# EAGLE design DashHub (EAGLE 9.6.2)
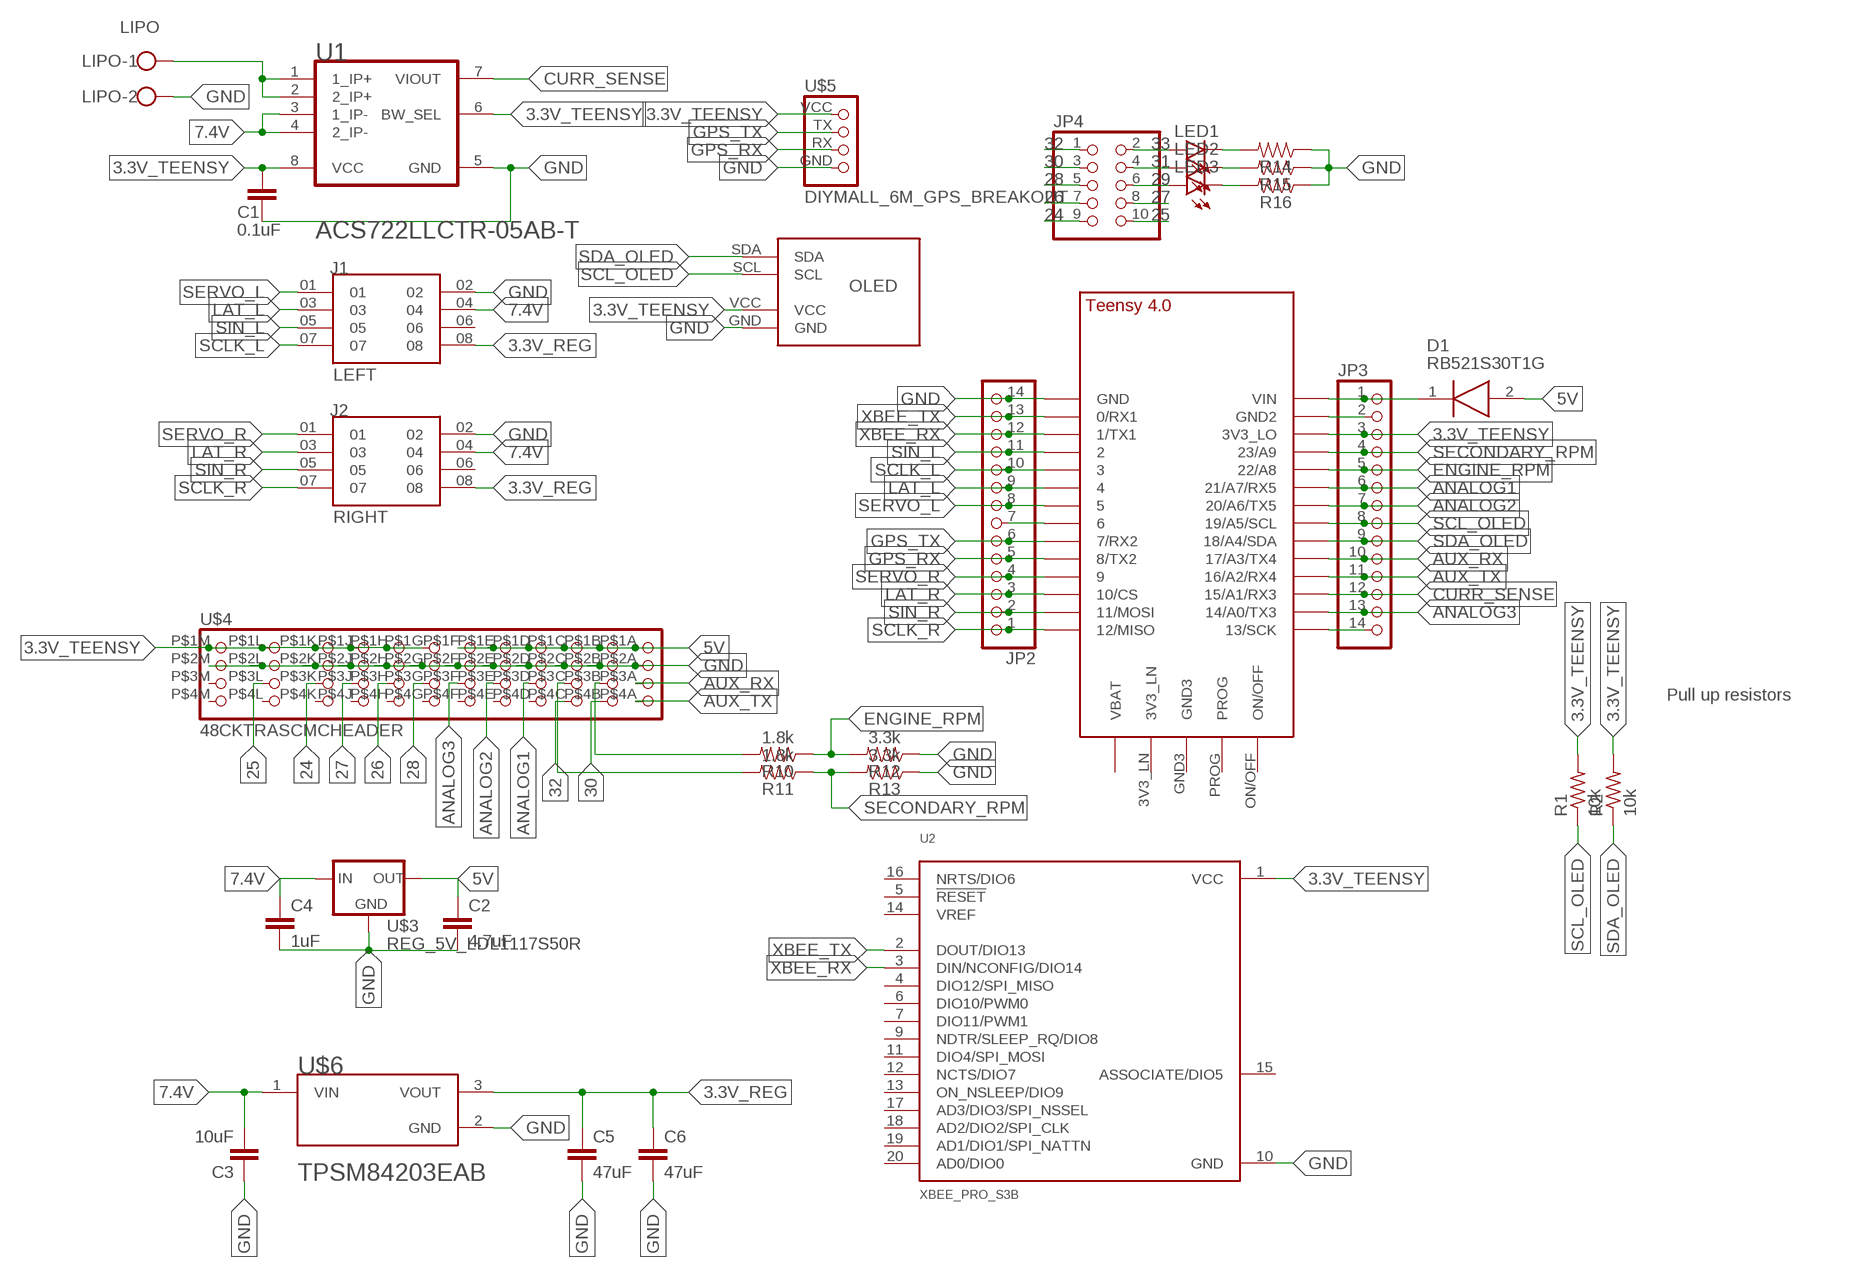
[diagram p0: schematic, sheet 1]

## Parts
C1  0.1uF  C-EUC0402  [C0402]
C2  4.7uF  CAP_SMDC0603  [C0603]
C3  10uF  CAP_SMDC1206  [C1206]
C4  1uF  CAP_SMDC1206  [C1206]
C5  47uF  CAP_SMDC1206  [C1206]
C6  47uF  CAP_SMDC1206  [C1206]
D1  RB521S30T1G  [SODFL1608X70N]
J1  LEFT  ESW-104-23-L-D  [SAMTEC_ESW-104-23-L-D]
J2  RIGHT  ESW-104-23-L-D  [SAMTEC_ESW-104-23-L-D]
JP2  PINHD-1X14  [1X14]
JP3  PINHD-1X14  [1X14]
JP4  PINHD-2X5  [2X05]
LED1  LEDCHIPLED_1206  [CHIPLED_1206]
LED2  LEDCHIPLED_1206  [CHIPLED_1206]
LED3  LEDCHIPLED_1206  [CHIPLED_1206]
LIPO  LIPO  W237-102  [W237-102]
R1  10k  RES_SMDR0603  [R0603]
R2  10k  RES_SMDR0603  [R0603]
R10  1.8k  RESISTORAXIAL-0.3  [AXIAL-0.3]
R11  1.8k  RESISTORAXIAL-0.3  [AXIAL-0.3]
R12  3.3k  RESISTORAXIAL-0.3  [AXIAL-0.3]
R13  3.3k  RESISTORAXIAL-0.3  [AXIAL-0.3]
R14  RESISTORAXIAL-0.3  [AXIAL-0.3]
R15  RESISTORAXIAL-0.3  [AXIAL-0.3]
R16  RESISTORAXIAL-0.3  [AXIAL-0.3]
U1  ALLEGRO_MICROSYSTEMS_ACS722LLCTR-05AB-TALLEGRO_MICROSYSTEMS_ACS722LLCTR-05AB-T_0_0  [ALLEGRO_MICROSYSTEMS_ACS722LLCTR-05AB-T_0]
U2  XBEE_PRO_S3B  [XBEE_PRO_S3B]
U$1  TEENSY_4.0-BASIC  [TEENSY_4.0-BASIC]
U$2  OLED_SSD1306  [OLED_SSD1306]
U$3  REG_5V_LDL1117S50R  [SOT230P700X180-4N]
U$4  48CKTRASCMCHEADER  [48CKTRASCMCHEADER]
U$5  DIYMALL_6M_GPS_BREAKOUT  [DIYMALL_6M_GPS_BREAKOUT]
U$6  TPSM84205EAB  [TPSM84205EAB]

## Nets
3.3V_REG: C5.1 C6.1 J1.08 J2.08 U$6.3(VOUT)
3.3V_TEENSY: C1.2 JP3.3 R1.2 R2.2 U1.6(BW_SEL) U1.8(VCC) U2.1(VCC) U$1.3V3_LO U$2.VCC U$4.P$1G(1G) U$4.P$1H(1H) U$4.P$1J(1J) U$4.P$1K(1K) U$4.P$1L(1L) U$4.P$1M(1M) U$5.VCC
5V: C2.1 D1.2(A) U$3.2(OUT) U$3.4(OUT) U$4.P$1A(1A) U$4.P$1B(1B) U$4.P$1C(1C) U$4.P$1D(1D) U$4.P$1E(1E) U$4.P$1F(1F)
7.4V: C3.2 C4.1 J1.04 J2.04 U1.3(1_IP-) U1.4(2_IP-) U$3.3(IN) U$6.1(VIN)
24: JP4.9 U$4.P$3K(3K)
25: JP4.10 U$4.P$3L(3L)
26: JP4.7 U$4.P$3H(3H)
27: JP4.8 U$4.P$3J(3J)
28: JP4.5 U$4.P$3G(3G)
29: JP4.6 LED3.A
30: JP4.3 U$4.P$4B(4B)
31: JP4.4 LED2.A
32: JP4.1 U$4.P$4C(4C)
33: JP4.2 LED1.A
ANALOG1: JP3.6 U$1.21/A7(21/A7/RX5) U$4.P$3D(3D)
ANALOG2: JP3.7 U$1.20/A6(20/A6/TX5) U$4.P$3E(3E)
ANALOG3: JP3.13 U$1.14/A0(14/A0/TX3) U$4.P$3F(3F)
AUX_RX: JP3.10 U$1.17/A3(17/A3/TX4) U$4.P$3A(3A)
AUX_TX: JP3.11 U$1.16/A2(16/A2/RX4) U$4.P$4A(4A)
CURR_SENSE: JP3.12 U1.7(VIOUT) U$1.15/A1(15/A1/RX3)
ENGINE_RPM: JP3.5 R10.P$1 R12.P$2 U$1.22/A8
GND: C1.1 C2.2 C3.1 C4.2 C5.2 C6.2 J1.02 J2.02 JP2.14 LIPO.2 R12.P$1 R13.P$1 R14.P$1 R15.P$1 R16.P$1 U1.5(GND) U2.10(GND) U$1.GND U$2.GND U$3.1(GND) U$4.P$2A(2A) U$4.P$2B(2B) U$4.P$2C(2C) U$4.P$2D(2D) U$4.P$2E(2E) U$4.P$2F(2F) U$4.P$2G(2G) U$4.P$2H(2H) U$4.P$2J(2J) U$4.P$2K(2K) U$4.P$2L(2L) U$4.P$2M(2M) U$5.GND U$6.2(GND)
GND2: JP3.2 U$1.GND2
GPS_RX: JP2.5 U$1.8(8/TX2) U$5.RX
GPS_TX: JP2.6 U$1.7(7/RX2) U$5.TX
LAT_L: J1.03 JP2.9 U$1.4/CANRX
LAT_R: J2.03 JP2.3 U$1.10/CS
LIPO_IN: LIPO.1 U1.1(1_IP+) U1.2(2_IP+)
N$1: JP2.7 U$1.6
N$2: D1.1(K) JP3.1 U$1.VIN
N$11: LED1.C R14.P$2
N$12: LED2.C R15.P$2
N$13: LED3.C R16.P$2
N$23: R10.P$2 U$4.P$3B(3B)
N$24: R11.P$2 U$4.P$3C(3C)
SCL_OLED: JP3.8 R1.1 U$1.19/A5/SCL U$2.SCL
SCLK_D: JP3.14 U$1.13/SCK
SCLK_L: J1.07 JP2.10 U$1.3/CANTX
SCLK_R: J2.07 JP2.1 U$1.12/MISO
SDA_OLED: JP3.9 R2.1 U$1.18/A4/SDA U$2.SDA
SECONDARY_RPM: JP3.4 R11.P$1 R13.P$2 U$1.23/A9
SERVO_L: J1.01 JP2.8 U$1.5
SERVO_R: J2.01 JP2.4 U$1.9/CS
SIN_L: J1.05 JP2.11 U$1.2
SIN_R: J2.05 JP2.2 U$1.11/MOSI
XBEE_RX: JP2.12 U2.3(DIN/NCONFIG/DIO14) U$1.1/TX(1/TX1)
XBEE_TX: JP2.13 U2.2(DOUT/DIO13) U$1.0/RX(0/RX1)
Unconnected: J1.06 J2.06 U2.4(DIO12/SPI_MISO) U2.5(!RESET) U2.6(DIO10/PWM0) U2.7(DIO11/PWM1) U2.9(NDTR/SLEEP_RQ/DIO8) U2.11(DIO4/SPI_MOSI) U2.12(NCTS/DIO7) U2.13(ON_NSLEEP/DIO9) U2.14(VREF) U2.15(ASSOCIATE/DIO5) U2.16(NRTS/DIO6) U2.17(AD3/DIO3/SPI_NSSEL) U2.18(AD2/DIO2/SPI_CLK) U2.19(AD1/DIO1/SPI_NATTN) U2.20(AD0/DIO0) U$1.3V3_LN U$1.GND3 U$1.ON/OFF U$1.PROG U$1.VBAT\(VBAT) U$4.P$3M(3M) U$4.P$4D(4D) U$4.P$4E(4E) U$4.P$4F(4F) U$4.P$4G(4G) U$4.P$4H(4H) U$4.P$4J(4J) U$4.P$4K(4K) U$4.P$4L(4L) U$4.P$4M(4M)

## Notes on the sheet
- Pull up resistors

## Library data of the parts
C1 = rcl:C-EU: CAPACITOR, European symbol; SPICEPREFIX: C
C2-C6 = GTOR - Passive Components:CAP_SMD: CAPACITOR, European symbol; SPICEPREFIX: C
D1 = RB521S30T1G:RB521S30T1G: Schottky Barrier Diode Source: Datasheet <http://www.onsemi.com/pub/Collateral/RB521S30T1-D.PDF>; ARROW_PART_NUMBER: RB521S30T1G; ARROW_PRICE-STOCK: https://www.arrow.com/en/products/rb521s30t1g/on-semiconductor; DESCRIPTION: Schottky Barrier Diode; HEIGHT: 0.7mm; MANUFACTURER_NAME: ON Semiconductor; MANUFACTURER_PART_NUMBER: RB521S30T1G; MOUSER_PART_NUMBER: 863-RB521S30T1G; MOUSER_PRICE-STOCK: https://www.mouser.co.uk/ProductDetail/ON-Semiconductor/RB521S30T1G?qs=xZq1yRCsb1eKFKS8TVH%2Fqg%3D%3D
J1 J2 = ESW-104-23-L-D:ESW-104-23-L-D; MANUFACTURER: Samtec Inc.; PARTREV: R; STANDARD: Manufacturer Recommendations
JP2 JP3 = pinhead:PINHD-1X14: PIN HEADER
JP4 = pinhead:PINHD-2X5: PIN HEADER
LED1-LED3 = led:LED: LED OSRAM: - CHIPLED LG R971, LG N971, LY N971, LG Q971, LY Q971, LO R971, LY R971 LH N974, LH R974 LS Q976, LO Q976, LY Q976 LO Q996 - Hyper CHIPLED LW Q18S LB Q993, LB Q99A, LB R99A - SideLED LS A670, LO A670, LY A670, LG A670, LP A670 LB A673, LV A673, LT A673, LW A673 LH A674 LY A675 LS A676, LA A676, LO A676, LY A676, LW A676 LS A679, LY A679, LG A679 - Hyper Micro SIDELED® LS Y876, LA Y876, LO Y876, LY Y876 LT Y87S - SmartLED LW L88C, LW L88S LB L89C, LB L89S, LG L890 LS L89K, LO L89K, LY L89K LS L896, LA L896, LO L896, LY L896 - TOPLED LS T670, LO T670, LY T670, LG T670, LP T670 LSG T670, LSP T670, LSY T670, LOP T670, LYG T670 LG T671, LOG T671, LSG T671 LB T673, LV T673, LT T673, LW T673 LH T674 LS T676, LA T676, LO T676, LY T676, LB T676, LH T676, LSB T676, LW T676 LB T67C, LV T67C, LT T67C, LS T67K, LO T67K, LY T67K, LW E67C LS E67B, LA E67B, LO E67B, LY E67B, LB E67C, LV E67C, LT E67C LW T67C LS T679, LY T679, LG T679 LS T770, LO T770, LY T770, LG T770, LP T770 LB T773, LV T773, LT T773, LW T773 LH T774 LS E675, LA E675, LY E675, LS T675 LS T776, LA T776, LO T776, LY T776, LB T776 LHGB T686 LT T68C, LB T68C - Hyper Mini TOPLED® LB M676 - Mini TOPLED Santana® LG M470 LS M47K, LO M47K, LY M47K Source: http://www.osram.convergy.de LUXEON: - LUMILED® LXK2-PW12-R00, LXK2-PW12-S00, LXK2-PW14-U00, LXK2-PW14-V00 LXK2-PM12-R00, LXK2-PM12-S00, LXK2-PM14-U00 LXK2-PE12-Q00, LXK2-PE12-R00, LXK2-PE12-S00, LXK2-PE14-T00, LXK2-PE14-U00 LXK2-PB12-K00, LXK2-PB12-L00, LXK2-PB12-M00, LXK2-PB14-N00, LXK2-PB14-P00, LXK2-PB14-Q00 LXK2-PR12-L00, LXK2-PR12-M00, LXK2-PR14-Q00, LXK2-PR14-R00 LXK2-PD12-Q00, LXK2-PD12-R00, LXK2-PD12-S00 LXK2-PH12-R00, LXK2-PH12-S00 LXK2-PL12-P00, LXK2-PL12-Q00, LXK2-PL12-R00 Source: www.luxeon.com KINGBRIGHT: KA-3528ASYC Source: www.kingbright.com
LIPO = con-wago-500:W237-102: WAGO SCREW CLAMP; MPN: 237-102; OC_FARNELL: unknown; OC_NEWARK: 70K9898
R1 R2 = GTOR - Passive Components:RES_SMD: RESISTOR, American symbol; SPICEPREFIX: R
R10-R16 = SparkFun-Resistors:RESISTOR: Generic Resistor Package
U1 = Allegro MicroSystems - ACS722LLCTR-05AB-T:ALLEGRO_MICROSYSTEMS_ACS722LLCTR-05AB-T: ALEG-ACS722-SOIC-8; CIIVA_IDS: 20395501; COMPONENT_LINK_1_DESCRIPTION: Manufacturer URL; COMPONENT_LINK_1_URL: http://www.allegromicro.com/; COMPONENT_LINK_3_DESCRIPTION: Package Specification; COMPONENT_LINK_3_URL: http://www.allegromicro.com/~/media/Files/Datasheets/ACS711-Datasheet.ashx?la=en; DATASHEET: http://www.allegromicro.com/~/media/Files/Datasheets/ACS722-Datasheet.ashx?la=en; FOOTPRINT_VARIANT_NAME_0: Manufacturer Recommended; IMPORTED: yes; IMPORTED_FROM: vault; IMPORT_TS: 1521843836; IP_MAX: 5 A; IP_MIN: -5 A; MF: Allegro MicroSystems; MOUNTING_TECHNOLOGY: Surface Mount; MPN: ACS722LLCTR-05AB-T; PACKAGE_DESCRIPTION: 8-Pin Small Outline Integrated Package, Body 4.9 x 3.9 mm, Pitch 1.27 mm; PACKING: Tape and Reel; PREFIX: U; RELEASE_DATE: 1439174706; ROHS: Yes; TEMPERATURE_MAX: 150 degC; TEMPERATURE_MIN: -40 degC; VAULT_GUID: 23CF8DBA-208E-4E0F-A1B8-C7EE78FE94DB; VAULT_REVISION: 60592E21-24CC-4A18-AB0C-D50A27DFFA24; VCC_MAX: 3.6 V; VCC_MIN: 3 V
U2 = GTOR - Microcontroller:XBEE_PRO_S3B: XBee-PRO 900HP DigiMesh 900 MHz 200 Kbps RF Module with U.FL Connector; DESCRIPTION: General ISM < 1GHz Transceiver Module 900MHz Antenna Not Included, RP-SMA Through Hole; DIGI-KEY_PART_NUMBER: 602-1293-ND; MF: Digi International; MP: XBP9B-XCST-001; PACKAGE: Module Digi International
U$1 = Teensy-4.0:TEENSY_4.0-BASIC
U$2 = GTOR - Breakout Boards:OLED_SSD1306
U$3 = GTOR - Active Components:REG_5V_LDL1117S50R
U$4 = GTOR - Connectors:48CKTRASCMCHEADER
U$5 = GTOR - Breakout Boards:DIYMALL_6M_GPS_BREAKOUT
U$6 = GTOR - Active Components:TPSM84205EAB

## Board
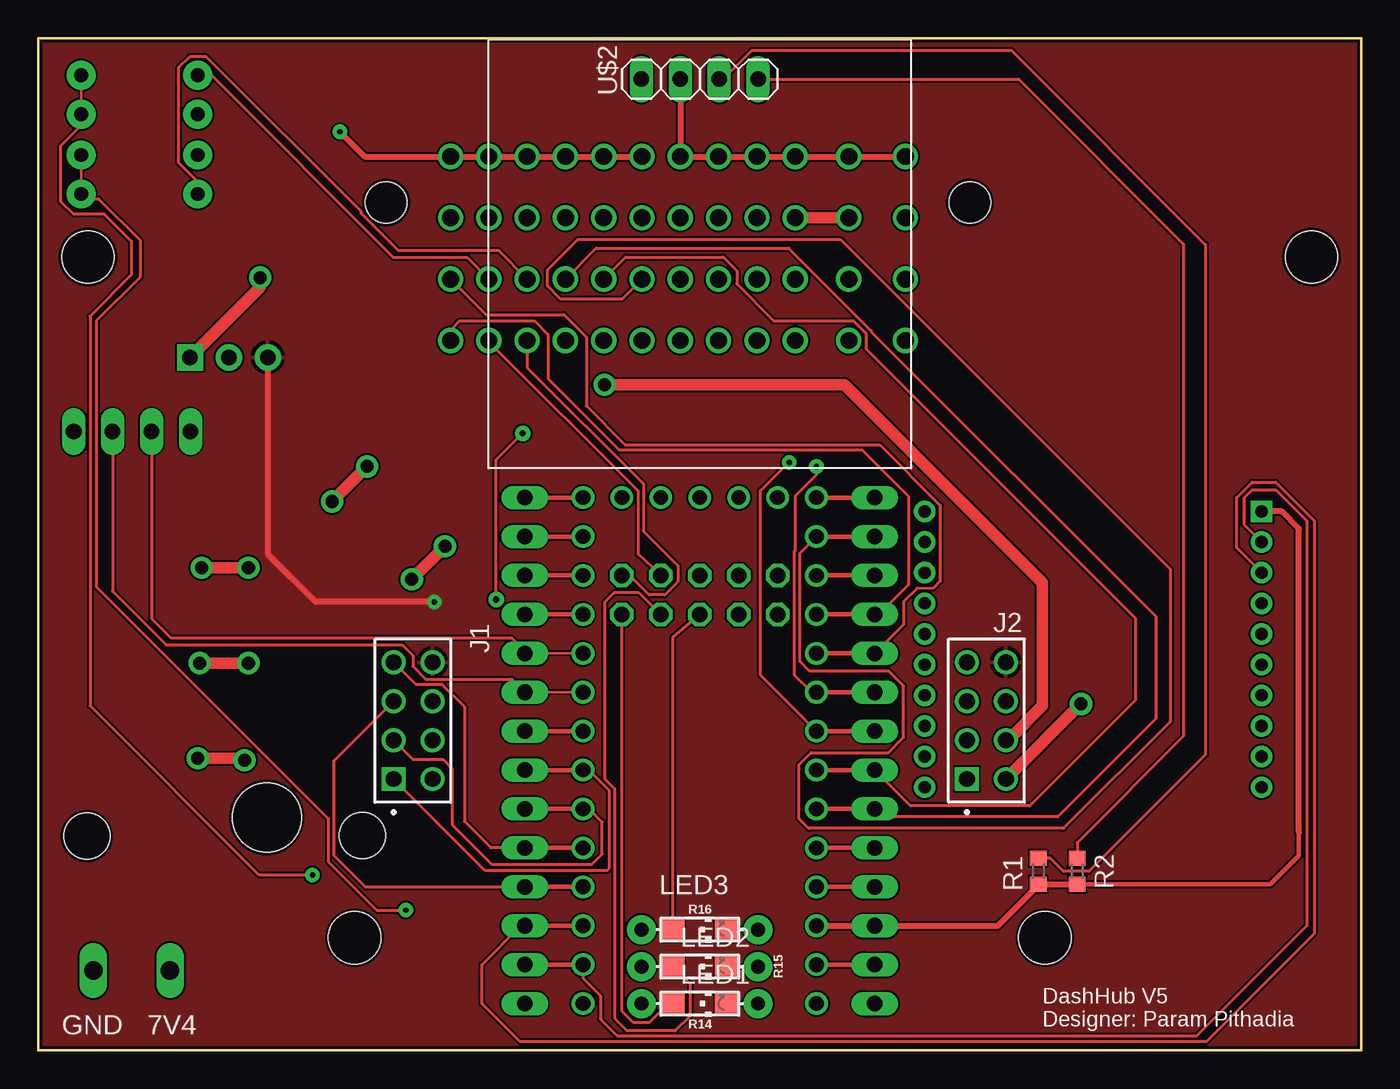
[diagram p1: board, top side]
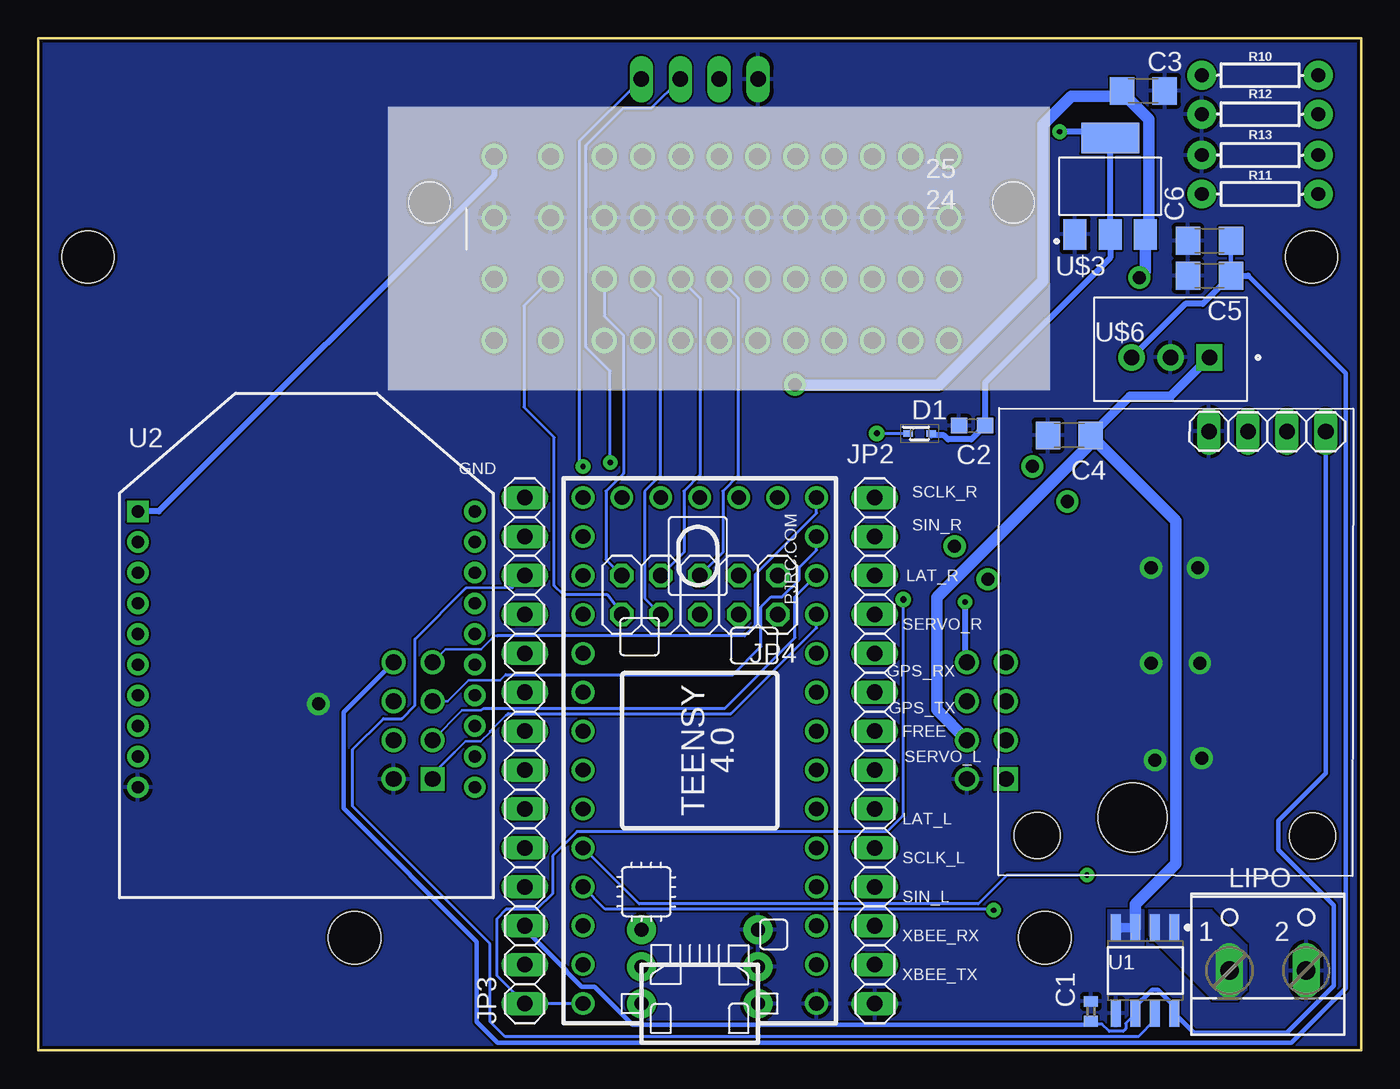
[diagram p2: board, bottom side, seen from below]

Size 86.36 x 66.04 mm. Coordinates in mm from the lower left corner, seen from the top.
Outline: 0,66.04 0,0 86.36,0 86.36,66.04 0,66.04
Copper layers (1*16): Top 0.035mm / dielectric 1.6mm / Bottom 0.035mm
Design rules "designrulecheck_jlcpcb_2layers": minimum track width 5mil, minimum drill 0.3mm, track to track 5mil, track to pad 0.2mm, pad to pad 5mil, via to via 10mil, smd to smd 5mil, copper to edge 0.2mm, drill to drill 0.5mm, minimum pad ring 10mil, minimum via ring 0.3mm, stop-mask expansion 4mil, vias tented up to drill 0mil, thermal gap 10mil
Holes 3.4 mm at 65.71,7.34 83.11,51.77 20.65,7.34 3.25,51.77

### Footprints (pad centres in the part's own frame; a part is rotated, then mirrored left to right if it is on the bottom)
C0402 = smd 0.7 x 0.9: 1 -0.65,0; 2 0.65,0
C0603 = smd 1.1 x 1: 1 -0.85,0; 2 0.85,0
C1206 = smd 1.6 x 1.8: 1 -1.4,0; 2 1.4,0
SODFL1608X70N = smd 0.64 x 0.42: 1 -0.75,0; 2 0.75,0
SAMTEC_ESW-104-23-L-D = drill 1.04 pad 1.39 square: 01 0,0 | drill 1.04 pad 1.39: 02 0,2.54; 03 -2.54,0; 04 -2.54,2.54; 05 -5.08,0; 06 -5.08,2.54; 07 -7.62,0; 08 -7.62,2.54
1X14 = drill 1.016 long: 1 -16.51,0; 2 -13.97,0; 3 -11.43,0; 4 -8.89,0; 5 -6.35,0; 6 -3.81,0; 7 -1.27,0; 8 1.27,0; 9 3.81,0; 10 6.35,0; 11 8.89,0; 12 11.43,0; 13 13.97,0; 14 16.51,0
2X05 = drill 1.016 octagon: 1 -5.08,-1.27; 2 -5.08,1.27; 3 -2.54,-1.27; 4 -2.54,1.27; 5 0,-1.27; 6 0,1.27; 7 2.54,-1.27; 8 2.54,1.27; 9 5.08,-1.27; 10 5.08,1.27
CHIPLED_1206 = smd 1.5 x 1.5: A 0,-1.75; C 0,1.75
W237-102 = drill 1.194 long: 1 -2.5,-1.27; 2 2.5,-1.27
R0603 = smd 1 x 1.1: 1 -0.85,0; 2 0.85,0
AXIAL-0.3 = drill 0.9 pad 1.88: P$1 -3.81,0; P$2 3.81,0
ALLEGRO_MICROSYSTEMS_ACS722LLCTR-05AB-T_0 = smd 0.65 x 1.75: 1 -1.905,-2.8; 2 -0.635,-2.8; 3 0.635,-2.8; 4 1.905,-2.8; 5 1.905,2.8; 6 0.635,2.8; 7 -0.635,2.8; 8 -1.905,2.8
XBEE_PRO_S3B = drill 0.8 pad 1.4 square: 1 -11,8.75 | drill 0.8 pad 1.4: 2 -11,6.75; 3 -11,4.75; 4 -11,2.75; 5 -11,0.75; 6 -11,-1.25; 7 -11,-3.25; 8 -11,-5.25; 9 -11,-7.25; 10 -11,-9.25; 11 11,-9.25; 12 11,-7.25; 13 11,-5.25; 14 11,-3.25; 15 11,-1.25; 16 11,0.75; 17 11,2.75; 18 11,4.75; 19 11,6.75; 20 11,8.75
TEENSY_4.0-BASIC = drill 0.965: 0/RX -13.97,-7.62; 1/TX -11.43,-7.62; 2 -8.89,-7.62; 3/CANTX -6.35,-7.62; 3V3_LN 16.51,-2.54; 3V3_LO -11.43,7.62; 4/CANRX -3.81,-7.62; 5 -1.27,-7.62; 6 1.27,-7.62; 7 3.81,-7.62; 8 6.35,-7.62; 9/CS 8.89,-7.62; 10/CS 11.43,-7.62; 11/MOSI 13.97,-7.62; 12/MISO 16.51,-7.62; 13/SCK 16.51,7.62; 14/A0 13.97,7.62; 15/A1 11.43,7.62; 16/A2 8.89,7.62; 17/A3 6.35,7.62; 18/A4/SDA 3.81,7.62; 19/A5/SCL 1.27,7.62; 20/A6 -1.27,7.62; 21/A7 -3.81,7.62; 22/A8 -6.35,7.62; 23/A9 -8.89,7.62; GND -16.51,-7.62; GND2 -13.97,7.62; GND3 16.51,0; ON/OFF 16.51,5.08; PROG 16.51,2.54; VBAT\ 16.51,-5.08; VIN -16.51,7.62
OLED_SSD1306 = drill 1.016 long: GND 0,-3.81; SCL 0,1.27; SDA 0,3.81; VCC 0,-1.27
SOT230P700X180-4N = smd 1.5 x 2: 1 -2.3,-3.15; 2 0,-3.15; 3 2.3,-3.15 | smd 3.8 x 2: 4 0,3.15
48CKTRASCMCHEADER = drill 1.1: P$1A 15,6; P$1B 12.5,6; P$1C 10,6; P$1D 7.5,6; P$1E 5,6; P$1F 2.5,6; P$1G 0,6; P$1H -2.5,6; P$1J -5,6; P$1K -7.5,6; P$1L -11,6; P$1M -14.7,6; P$2A 15,2; P$2B 12.5,2; P$2C 10,2; P$2D 7.5,2; P$2E 5,2; P$2F 2.5,2; P$2G 0,2; P$2H -2.5,2; P$2J -5,2; P$2K -7.5,2; P$2L -11,2; P$2M -14.7,2; P$3A 15,-2; P$3B 12.5,-2; P$3C 10,-2; P$3D 7.5,-2; P$3E 5,-2; P$3F 2.5,-2; P$3G 0,-2; P$3H -2.5,-2; P$3J -5,-2; P$3K -7.5,-2; P$3L -11,-2; P$3M -14.7,-2; P$4A 15,-6; P$4B 12.5,-6; P$4C 10,-6; P$4D 7.5,-6; P$4E 5,-6; P$4F 2.5,-6; P$4G 0,-6; P$4H -2.5,-6; P$4J -5,-6; P$4K -7.5,-6; P$4L -11,-6; P$4M -14.7,-6 | hole 2.7: -18.9,3; 19.2,3
DIYMALL_6M_GPS_BREAKOUT = drill 1.016 long: GND 1.5,13.69; RX 1.5,16.23; TX 1.5,18.77; VCC 1.5,21.31 | hole 3: 27.9,2.5; 27.9,20.5 | hole 4.5: 26.7,8.75
TPSM84205EAB = drill 1.01 pad 1.71 square: 1 -2.54,0 | drill 1.01 pad 1.71: 2 0,0; 3 2.54,0

### Placement (x,y rotation side)
C1  17.65,2.54 270 bottom
C2  25.4,40.77 180 bottom
C3  14.22,62.61 180 bottom
C4  19.05,40.13 180 bottom
C5  9.91,50.55 180 bottom
C6  9.91,52.83 180 bottom
D1  28.83,40.26 0 bottom
J1  23.19,17.7 270 top
J2  60.63,17.7 270 top
JP2  31.75,19.56 270 bottom
JP3  54.61,19.56 90 bottom
JP4  43.18,29.72 180 bottom
LED1  43.18,3.05 270 top
LED2  43.18,5.46 270 top
LED3  43.18,7.87 270 top
LIPO  6.1,6.48 0 bottom
R1  65.28,11.68 270 top
R2  67.82,11.68 270 top
R10  6.6,63.63 180 bottom
R11  6.6,55.88 180 bottom
R12  6.6,61.09 0 bottom
R13  6.6,58.42 0 bottom
R14  100  [AXIAL-0.3]  43.18,3.05 0 top
R15  100  [AXIAL-0.3]  43.18,5.46 0 top
R16  100  [AXIAL-0.3]  43.18,7.87 0 top
U1  14.1,5.21 180 bottom
U2  68.86,26.42 0 bottom
U$1  43.18,19.56 90 bottom
U$2  43.18,63.37 270 top
U$3  16.38,56.39 0 bottom
U$4  41.91,52.32 0 bottom
U$5  23.62,41.91 269.9 bottom
U$6  12.45,45.21 180 bottom

### Tracks (layer width: path | path; a pad name or v marks a point on that pad's centre or on a via)
3.3V_REG  (via drill 0.35)
  Top 0.406: U$6.3 14.99,32.39 18.11,29.26 v25.86,29.26
  Bottom 0.279: C6.1 C5.1
  Bottom 0.305: 7.37,50.55 1.02,44.19 1.02,4.06 4.57,0.51 56.39,0.51 57.73,1.85 57.73,7.1 66.42,15.78 66.42,22.07 J2.08
  Bottom 0.406: v25.86,29.26 25.86,25.46 J1.08 | 7.37,50.55 C5.1 10.35,48.7 11.5,48.7 U$6.3
  pour Top: 101.35,73.03 101.35,-0.63 -9.09,-0.63 -18.23,8.51 -18.23,73.84 -15.88,76.2 98.17,76.2
3.3V_TEENSY
  Top 0.305: R2.2 80.43,10.83 82.3,12.7 82.3,14.22
  Top 0.406: U$4.P$1M U$4.P$1L U$4.P$1K U$4.P$1J U$4.P$1H U$4.P$1G U$2.VCC | U$1.3V3_LO JP3.3 62.64,8.13 65.28,10.77 R1.2 R2.2 | 82.3,14.22 82.3,34.04 81.17,35.17 U2.1
  Bottom 0.203: U1.6 15.38,1.76 15.38,1.41 15.55,1.23 16.45,1.23 16.93,1.71 17.84,1.71
  Bottom 0.305: U$5.VCC 2.31,18.09 5.4,15 5.4,13.08 1.78,9.45 1.78,4.21 4.85,1.14 10.92,1.14 U1.8 12.19,2.86 13.27,3.94 13.65,3.94 14.83,2.76 14.83,2.5 U1.6 | C1.2 17.84,1.71 17.87,1.68 47.58,1.68 50.03,4.14 50.89,4.14 51.89,5.14 51.89,5.2 54.61,7.93 JP3.3
  Bottom 0.406: U$4.P$1M 56.61,57.05 78.49,35.17 U2.1
5V  (via drill 0.35)
  Top 0.406: v19.68,59.94 21.3,58.32 U$4.P$1A U$4.P$1B U$4.P$1C U$4.P$1D U$4.P$1E U$4.P$1F
  Bottom 0.406: D1.2 28.08,40.13 27.23,40.13 26.97,39.86 25.45,39.86 C2.1 24.55,43.56 16.38,51.73 U$3.2 U$3.4 16.79,59.94 v19.68,59.94
7.4V  (via drill 0.85)
  Top 0.762: v14.48,50.43 14.48,49.78 U$6.1 | J2.04 63.32,20.24 65.55,22.47 65.55,30.52 52.63,43.43 v36.96,43.43
  Bottom 0.61: U1.3 U1.4 | U$6.1 12.45,42.67 15.11,42.67 C4.1
  Bottom 0.762: v14.48,50.43 14.08,50.83 U$3.3 13.85,53.47 13.85,60.75 15.62,62.52 C3.2 15.97,62.26 18.94,62.26 20.79,60.4 20.79,59.48 20.78,59.47 20.78,50.21 27.6,43.39 36.92,43.39 v36.96,43.43 | U1.3 14.73,9.54 12.09,12.19 12.09,34.54 17.65,40.11 C4.1 17.65,39.62 27.71,29.56 27.71,22.23 J1.04
  pour Bottom (no thermals): 14.22,9.14 14.22,6.86 16.51,6.86 16.51,9.14
24
  Bottom 0.203: JP4.9 49.3,32.03 49.3,36.5 48.16,37.64 48.16,46.66 49.41,47.92 U$4.P$3K
25
  Bottom 0.203: JP4.10 49.21,29.72 52.07,29.72 52.68,30.33 52.68,40.01 54.65,41.98 54.65,48.58 U$4.P$3L
26
  Bottom 0.203: U$4.P$3H 43.16,49.07 43.16,37.56 44.22,36.5 44.22,32.49 JP4.7
27
  Bottom 0.203: U$4.P$3J 45.77,49.18 45.77,37.49 46.78,36.47 46.78,29.51 JP4.8
28
  Bottom 0.203: U$4.P$3G 40.69,49.11 40.69,37.48 41.68,36.5 41.68,32.49 JP4.5
29
  Top 0.203: LED3.A 41.43,26.95 JP4.6
30
  Top 0.203: JP4.3 39.17,32.36 39.17,36.49 29.41,46.25 U$4.P$4B
31
  Top 0.203: JP4.4 40.62,28.45 39.22,29.85 37.59,29.85 36.98,29.23 36.98,17.72 37.62,17.08 37.62,2.09 38.44,1.27 41.58,1.27 42.55,2.24 42.55,4.35 LED2.A
32
  Top 0.203: JP4.1 38.61,30.99 39.88,29.72 40.9,29.72 41.76,30.58 41.76,31.62 39.5,33.88 39.5,36.96 31.91,44.54 U$4.P$4C
33
  Top 0.203: JP4.2 38.1,2.56 38.86,1.81 39.88,1.81 41.13,3.05 LED1.A
ANALOG1
  Top 0.203: JP3.6 55.12,15.24 66.55,15.24 72.94,21.63 72.94,28.33 54.37,46.9 54.37,46.96 48.98,52.34 36.42,52.34 U$4.P$3D
  Top 0.305: JP3.6 U$1.21/A7
ANALOG2
  Top 0.203: JP3.7 56.94,15.96 64.73,15.96 71.63,22.86 71.63,28.19 54.04,45.78 54.04,46.79 53.21,47.62 48,47.62 45.6,50.02 45.6,50.88 44.72,51.76 38.34,51.76 U$4.P$3E
  Top 0.305: JP3.7 U$1.20/A6
ANALOG3
  Top 0.203: U$1.14/A0 49.71,32.44 49.71,25.38 50.35,24.74 55.53,24.74 56.49,23.78 56.49,20.42 55.5,19.43 50.45,19.43 49.66,18.64 49.66,15.11 50.29,14.48 66.92,14.48 73.89,21.44 73.89,31.4 52.36,52.93 35.23,52.93 33.23,50.93 33.23,49.89 34.1,49.02 38.11,49.02 U$4.P$3F
  Top 0.305: JP3.13 U$1.14/A0
AUX_RX
  Top 0.178: 58.42,30.16 57.38,30.16
  Top 0.203: 57.38,30.16 56.52,29.3 56.52,27.81 JP3.10 | 58.42,30.16 58.86,30.6 58.86,35.58 54.93,39.52 38.31,39.52 35.78,42.05 35.78,46.54 34.32,48.01 29.23,48.01 U$4.P$3A
  Top 0.305: JP3.10 U$1.17/A3
AUX_TX
  Top 0.203: U$4.P$4A 26.91,46.99 27.51,47.59 32.38,47.59 33.28,46.7 33.28,43.83 37.92,39.19 53.76,39.19 56.8,36.14 56.8,30.39 54.86,28.45 JP3.11
  Top 0.305: JP3.11 U$1.16/A2
CURR_SENSE
  Top 0.305: JP3.12 U$1.15/A1
  Bottom 0.178: 58.42,30.17 55.43,30.17
  Bottom 0.203: U1.7 13.46,1.99 14.56,0.89 55.88,0.89 56.87,1.88 56.87,6.95 65.84,15.92 65.84,19.64 63.83,21.65 62.62,21.65 61.77,22.51 61.77,26.83 58.42,30.17 | 55.43,30.17 JP3.12
ENGINE_RPM  (via drill 0.35)
  Top 0.152: R10.P$1 R12.P$2
  Top 0.203: v17.91,11.43 14.43,11.43 3.38,22.48 3.38,47.91 6.07,50.6 6.07,52.81 4.32,54.56 2.3,54.56 1.47,55.39 1.47,59.04 2.79,60.36 R12.P$2
  Top 0.305: JP3.5 U$1.22/A8
  Bottom 0.203: U$1.22/A8 47.14,9.55 24.99,9.55 23.11,11.43 18.16,11.43 v17.91,11.43
GND  (via drill 0.85)
  Top 0.762: v10.67,31.5 v13.72,31.5 | v10.54,25.27 v13.72,25.27 | v10.41,19.05 13.34,19.05 v13.46,18.92 | J2.02 v68.07,22.61 | U$4.P$2L U$4.P$2K
  pour Bottom (rank 5): -13.45,71.77 -13.45,5.33 -7.1,-1.02 99.06,-1.02 99.06,72.14 98.42,72.77 -12.45,72.77
GND1  (via drill 0.85)
  Top 0.762: v21.46,38.1 v19.18,35.81
GND2
  Top 0.305: JP3.2 U$1.GND2
GND3  (via drill 0.85)
  Top 0.762: v24.38,30.73 v26.54,32.89
GPS_RX
  Top 0.152: U$1.8 JP2.5
  Top 0.203: U$5.RX 7.4,28.17 8.64,26.92 30.9,26.92 31.75,26.06 JP2.5
GPS_TX
  Top 0.152: U$1.7 JP2.6
  Top 0.203: U$5.TX 4.85,29.94 8.34,26.46 23.73,26.46 24.45,25.74 24.45,25.05 25.28,24.22 30.92,24.22 31.75,23.39 JP2.6
LAT_L
  Top 0.203: J1.03 24.44,18.99 26.41,18.99 27.02,18.39 27.02,14.73 29.6,12.14 36.15,12.14 36.8,12.8 36.8,14.89 35.95,15.75 U$1.4/CANRX
  Top 0.305: JP2.9 U$1.4/CANRX
LAT_R
  Top 0.305: JP2.3 U$1.10/CS
  Bottom 0.178: 57.28,22.3 57.33,22.3 57.45,22.18 58.7,22.18 J2.03
  Bottom 0.203: 57.28,22.3 41.58,22.3 36.96,26.92 36.96,29.59 U$1.10/CS
LIPO_IN
  pour Bottom (no thermals): 13.84,9.14 13.84,7.49 9.65,3.3 8.13,3.3 7.49,3.94 7.49,6.86 9.78,9.14
N$1
  Top 0.305: JP2.7 U$1.6
N$2  (via drill 0.4)
  Top 0.203: v29.89,29.42 29.89,38.53 v31.62,40.26
  Bottom 0.203: U$1.VIN JP3.1 54.61,3.07 56.44,4.89 56.44,8.57 55.81,9.19 53.82,9.19 52.78,10.23 52.78,12.69 51.2,14.27 30.96,14.27 29.92,15.31 29.92,29.39 v29.89,29.42 | v31.62,40.26 D1.1
N$11
  Top 0.203: R14.P$2 LED1.C
N$12
  Top 0.203: R15.P$2 LED2.C
N$13
  Top 0.203: R16.P$2 LED3.C
N$23
  Top 0.203: R10.P$2 11.3,63.63 23.18,51.75 27.98,51.75 U$4.P$3B
N$24
  Top 0.203: R11.P$2 10.41,56.66 9.17,57.91 9.17,64.14 9.9,64.87 10.93,64.87 21.06,54.74 21.06,54.64 23.5,52.2 30.04,52.2 U$4.P$3C
SCL_OLED  (via drill 0.35)
  Top 0.203: U$1.19/A5/SCL 47.14,24.49 47.14,36.53 48.97,38.35 v49.02,38.35 | U$2.SCL 44.7,63.37 46.58,65.25 63.52,65.25 76.2,52.58 76.2,19.29 68.59,11.68 66.92,11.68 66.06,12.53 R1.1
  Top 0.305: U$1.19/A5/SCL JP3.8
  Bottom 0.203: v49.02,38.35 49.02,44.32 50.59,45.89 50.59,59.06 48.15,61.49 46.33,61.49 U$2.SCL
SCLK_D
  Top 0.305: U$1.13/SCK JP3.14
SCLK_L
  Top 0.203: J1.07 24.62,23.89 26.34,23.89 27.81,22.42 27.81,14.95 29.55,13.21 JP2.10
  Top 0.305: JP2.10 U$1.3/CANTX
SCLK_R
  Top 0.305: U$1.12/MISO JP2.1
  Bottom 0.178: 56.39,27.05 56.58,27.05 57.45,26.18 59.78,26.18 J2.07
  Bottom 0.203: U$1.12/MISO 35.56,35.06 39.57,31.04 39.57,27.74 40.26,27.05 56.39,27.05
SDA_OLED  (via drill 0.35)
  Top 0.203: U$1.18/A4/SDA 50.49,23.37 49.38,24.48 49.38,32.57 49.4,32.6 49.4,36.16 50.8,37.56 v50.8,38.1 | U$2.SDA 64.01,63.37 74.76,52.62 74.76,20.5 67.82,13.55 R2.1
  Top 0.305: JP3.9 U$1.18/A4/SDA
  Bottom 0.203: v50.8,38.1 51.05,38.35 51.05,59.32 U$2.SDA
SECONDARY_RPM  (via drill 0.35)
  Top 0.152: R13.P$2 R11.P$1
  Top 0.203: R11.P$1 3.12,55.55 3.96,55.55 6.64,52.87 6.64,50.45 3.79,47.6 3.79,30.25 18.92,15.11 18.92,12.32 22.1,9.14 v24,9.14
  Top 0.305: JP3.4 U$1.23/A9
  Bottom 0.203: U$1.23/A9 49.35,9.22 24,9.22 v24,9.14
SERVO_L
  Top 0.203: J1.01 29.14,11.75 37.15,11.75 37.29,11.89 37.29,16.95 35.95,18.29 U$1.5
  Top 0.305: JP2.8 U$1.5
SERVO_R
  Top 0.305: JP2.4 U$1.9/CS
  Bottom 0.178: 55.71,21.93 55.76,21.88 55.81,21.88 56.87,20.82 56.87,20.76 57.47,20.16 58.47,20.16 59.19,19.44
  Bottom 0.203: J2.01 60.63,18 59.19,19.44 | 55.71,21.93 55.67,21.97 41.15,21.97 35.56,27.56 U$1.9/CS
SIN_L
  Top 0.203: JP2.11 21.34,10.67 19.3,12.7 19.3,18.9 J1.05
  Top 0.305: JP2.11 U$1.2
SIN_R
  Top 0.305: JP2.2 U$1.11/MOSI
  Bottom 0.178: 55.86,24.51 56.21,24.16 58.27,24.16 59.64,22.78 J2.05
  Bottom 0.203: 55.86,24.51 41.02,24.51 39.17,26.37 39.17,28.95 38.52,29.59 37.81,29.59 36.68,30.72 36.68,31.53 35.56,32.64 U$1.11/MOSI
XBEE_RX
  Top 0.203: U2.3 78.23,32.79 78.23,36.07 79.25,37.08 80.77,37.08 83.31,34.54 83.31,7.62 76.25,0.56 31.45,0.56 28.96,3.05 28.96,5.59 31.5,8.13
  Top 0.305: 31.5,8.13 JP2.12 U$1.1/TX
XBEE_TX
  Top 0.203: U2.2 78.74,34.29 78.74,36.07 79.25,36.58 80.77,36.58 82.8,34.54 82.8,8.13 75.62,0.94 37.8,0.94 36.7,2.03 36.7,3.56 35.56,4.7 U$1.0/RX
  Top 0.305: JP2.13 U$1.0/RX

### Text on the board
tPlace: DashHub V5 / Designer: Param Pithadia | GND | 7V4
bPlace: 25 | 24 | GND | SCLK_R | SIN_R | LAT_R | SERVO_R | GPS_RX | GPS_TX | FREE | SERVO_L | LAT_L | SCLK_L | SIN_L | XBEE_RX | XBEE_TX